# Altium schematic sheet PPG (MAX30102).SchDoc
size A; SheetNumber: 7; SheetTotal: 9
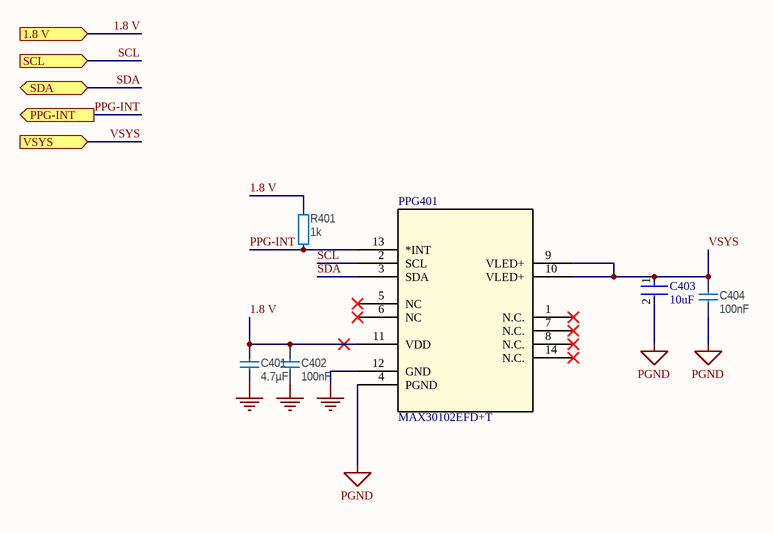
[diagram p0: PPG (MAX30102).SchDoc]

## Parts
C401  4.7µF  [CAPC1608X06L]
C402  100nF  [CAPC0603X03L_C]
C403  10uF  [FP-GRM188-0_2-MFG]
C404  100nF  [CAPC0603X03L_C]
PPG401  MAX30102EFD+T  [21-1048_F143A5+1_MXM]
R401  1k  [RESC0603X03L_C]

## Ports
1.8 V (in, see Digital_Watch[1C], IMU (BMI270)[1A], Level Shifter (PCA9306JKZ)[2B], PMIC (nPM1300)[3B]), PPG-INT (out, see Digital_Watch[1C], MCU (nrf5340)[3D]), SCL (in, see Digital_Watch[1C], IMU (BMI270)[1A], Level Shifter (PCA9306JKZ)[2B], MCU (nrf5340)[4C], PMIC (nPM1300)[2C]), SDA (bidir, see Digital_Watch[1C], IMU (BMI270)[1B], Level Shifter (PCA9306JKZ)[2B], MCU (nrf5340)[4C], PMIC (nPM1300)[2C]), VSYS (in, see Digital_Watch[1C], PMIC (nPM1300)[3B])

## Nets
GND: C401.1 C402.1 PPG401.12(GND)
PGND: C403.2 C404.1 PPG401.4(PGND)
1.8 V: C401.2 C402.2 PPG401.11(VDD) R401.2 ; port 1.8 V
PPG-INT: PPG401.13(*INT) R401.1 ; port PPG-INT
SCL: PPG401.2(SCL) ; port SCL
SDA: PPG401.3(SDA) ; port SDA
VSYS: C403.1 C404.2 PPG401.9(VLED+) PPG401.10(VLED+) ; port VSYS

Not connected (* = marked no-connect by the designer): PPG401 1(N.C.)* 5(NC)* 6(NC)* 7(N.C.)* 8(N.C.)* 14(N.C.)*

## Library data of the parts
C401 = C0603-4µ7-10V-X7S: Capacitor, X7S, ±10%; Pad Count: 2; Value: 4.7µF; Footprint Doc: 0603; Component Class: Capacitors; Author: rsk
C402 C404 = C0201-100n-16V-X7S: Capacitor, X7S, ±10%; Pad Count: 2; Value: 100nF; Footprint Doc: 0201; Component Class: Capacitors; Author: rsk
C403 = CMP-2006-02520-2: Chip Multilayer Ceramic Capacitors for General Purpose, 0603, 10uF, X5R, 15%, 20%, 25V; Tolerance: 20%; Resistor Type: Ceramic; Voltage: 25V; Max Operating Temperature: 85°C; Min Operating Temperature: -55°C; Capacitance: 10uF; Dielectric: X5R; Lead Free: Lead Free; REACH SVHC: No SVHC; Case/Package: 0603; Mount: Surface Mount; Voltage Rating (DC): 25V; Height: 0.8mm; Length: 1.6mm; Thickness: 0.031inch; Width: 0.031inch; Termination: SMD/SMT; Case Code (Imperial): 0603; Case Code (Metric): 1608; Package Quantity: 1; Packaging: Tape and Reel; Depth: 0.8mm; Voltage Rating: 25V; Weight: 0.000222oz; Number of Pins: 2
PPG401 = MAX30102EFD+T: High-Sensitivity Pulse Oximeter and Heart-Rate Sensor for Wearable Health; Manufacturer: Analog Devices; Manufacturer Lifecycle Status: PRODUCTION; Supplier: Newark; Supplier Part Number: MAX30102EFD+T; Manufacturer Part Number: MAX30102EFD+T; RoHS: Compliant; Category: Sensors; Stock: 3293; Pricing: 1=14.08, 10=11.09, 25=10.35, 50=10.07, 100=9.81 (USD); Lifecycle Status: Production; Max Operating Temperature: 85°C; Min Operating Temperature: -40°C; Pins: 14; ComponentLink1URL: https://datasheet.octopart.com:443/MAX30102EFD%2BT-Analog-Devices-datasheet-138896825.pdf?src-supplier=Newark; ComponentLink1Description: https://datasheet.octopart.com:443/MAX30102EFD%2BT-Analog-Devices-datasheet-138896825.pdf?src-supplier=Newark; ComponentLink2URL: https://octopart.com:443/opatz8j6/c1?t=lNLdbXEB-8Tfy8yyi4Ep1fg7LQBHMOUji7viRAxOBTnstiUziOP12QkdXpxsJz2gTCdMLFd-o1sQhiq2QGCXJAw1OXoBq43W6EvqANHznVSVXZIvjcOQ14Y9w58vDVvxUyf5yLP6ooKDBR_TMbQokFu0a_69z_GhI_gBgFQO_qOVaRFVU7xfxZqeajADuRKWlhE-FhNjkerkGbayOHC05gfclkqna1nR66NbwE0W05Kd5w-3rkyZdBWpea1K5kTkzC5cc6dy1LvAz2CYcaBGdRuMedz6_0DBNqLseYE7_4nUa2FvBnotLbJr&src-supplier=Analog+Devices; ComponentLink2Description: https://octopart.com:443/opatz8j6/c1?t=lNLdbXEB-8Tfy8yyi4Ep1fg7LQBHMOUji7viRAxOBTnstiUziOP12QkdXpxsJz2gTCdMLFd-o1sQhiq2QGCXJAw1OXoBq43W6EvqANHznVSVXZIvjcOQ14Y9w58vDVvxUyf5yLP6ooKDBR_TMbQokFu0a_69z_GhI_gBgFQO_qOVaRFVU7xfxZqeajADuRKWlhE-FhNjkerkGbayOHC05gfclkqna1nR66NbwE0W05Kd5w-3rkyZdBWpea1K5kTkzC5cc6dy1LvAz2CYcaBGdRuMedz6_0DBNqLseYE7_4nUa2FvBnotLbJr&src-supplier=Analog+Devices; ComponentLink3URL: https://sigma.octopart.com:443/140085706/technical_drawing/Maxim-Integrated-MAX30102EFD%2BT.pdf?src-supplier=ShanghaiCT; ComponentLink3Description: https://sigma.octopart.com:443/140085706/technical_drawing/Maxim-Integrated-MAX30102EFD%2BT.pdf?src-supplier=ShanghaiCT; ComponentLink4URL: https://datasheet.octopart.com:443/MAX30102EFD%2BT-Maxim-Integrated-datasheet-65703272.pdf?src-supplier=Future+Electronics; ComponentLink4Description: https://datasheet.octopart.com:443/MAX30102EFD%2BT-Maxim-Integrated-datasheet-65703272.pdf?src-supplier=Future+Electronics; ComponentLink5URL: http://sigma.octopart.com:80/conflict_mineral_statement/Analog-Devices-company-33.pdf?src-supplier=Compliance+Statements; ComponentLink5Description: http://sigma.octopart.com:80/conflict_mineral_statement/Analog-Devices-company-33.pdf?src-supplier=Compliance+Statements; ComponentLink6URL: http://sigma.octopart.com:80/reach_statement/Maxim-Integrated-company-67.pdf?src-supplier=Compliance+Statements; ComponentLink6Description: http://sigma.octopart.com:80/reach_statement/Maxim-Integrated-company-67.pdf?src-supplier=Compliance+Statements; ComponentLink7URL: http://sigma.octopart.com:80/rohs_statement/Maxim-Integrated-company-66.pdf?src-supplier=Compliance+Statements; ComponentLink7Description: http://sigma.octopart.com:80/rohs_statement/Maxim-Integrated-company-66.pdf?src-supplier=Compliance+Statements; ComponentLink8URL: http://sigma.octopart.com:80/conflict_mineral_statement/Maxim-Integrated-company-65.pdf?src-supplier=Compliance+Statements; ComponentLink8Description: http://sigma.octopart.com:80/conflict_mineral_statement/Maxim-Integrated-company-65.pdf?src-supplier=Compliance+Statements; ComponentLink9URL: https://octopart.com:443/opatz8j6/c1?t=GsCt6aUpOQZgLTAwy0RBe6VsdHe-YM9CHSfZbpG2BIHTLL6za4yMq7SeTLKgtsalxQzcPM4gwltrYJQATWSkjq-ZOauWDS99dmEtuyDrm5CMyiSwn4YVYgrc5-8zEVaZQwsVrbhWgf4IihAwKWxSwuC3IuAlEmd_BDG_ezWI42kw2SprHEToFG0VN0FjC_hwMAdTZF1mnz1-AXLMt1O2U-REnbHhwnY4I5_cRgWL3NsbmJbHfrYGaigF3NkWMAVHGLmDUv6I_DszeMkKCRV1y439GhWoj1xfZe8LgWUXVUrh8MonsIarQGZ5&src-supplier=Compliance+Statements; ComponentLink9Description: https://octopart.com:443/opatz8j6/c1?t=GsCt6aUpOQZgLTAwy0RBe6VsdHe-YM9CHSfZbpG2BIHTLL6za4yMq7SeTLKgtsalxQzcPM4gwltrYJQATWSkjq-ZOauWDS99dmEtuyDrm5CMyiSwn4YVYgrc5-8zEVaZQwsVrbhWgf4IihAwKWxSwuC3IuAlEmd_BDG_ezWI42kw2SprHEToFG0VN0FjC_hwMAdTZF1mnz1-AXLMt1O2U-REnbHhwnY4I5_cRgWL3NsbmJbHfrYGaigF3NkWMAVHGLmDUv6I_DszeMkKCRV1y439GhWoj1xfZe8LgWUXVUrh8MonsIarQGZ5&src-supplier=Compliance+Statements
R401 = R0201: Resistor, ±1%, 0.05W; Pad Count: 2; Footprint Doc: 0201; Value: 1k; Component Class: Resistors; Author: rsk